# EAGLE design motherboardv2 (EAGLE 5.11)
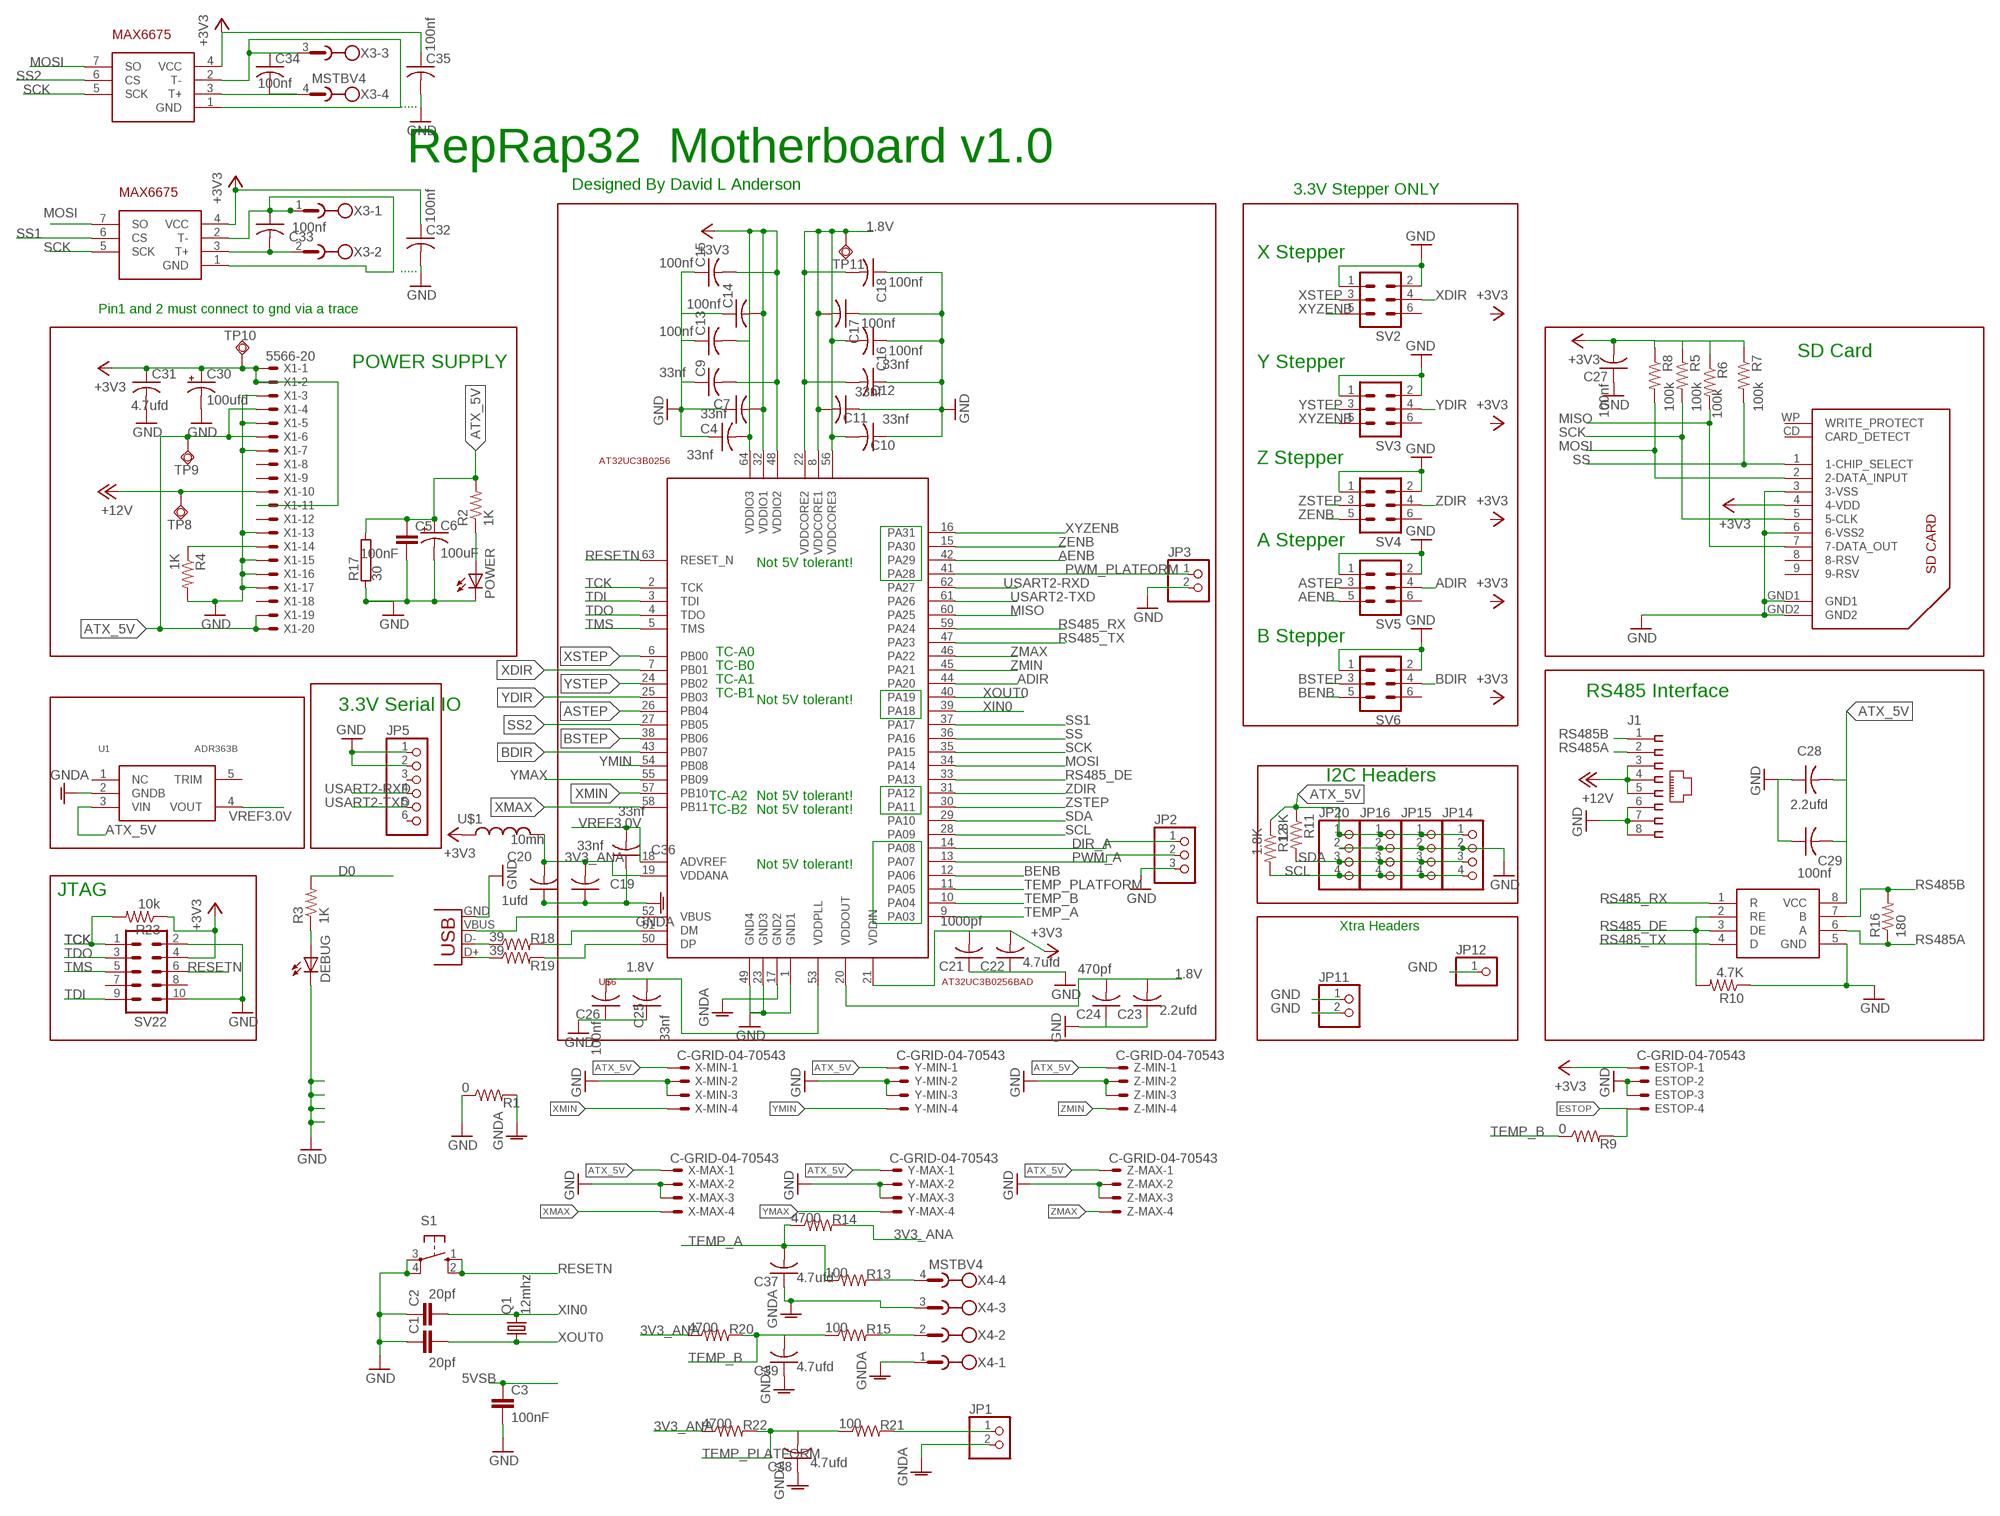
[diagram p0: schematic, sheet 1]

## Parts
C1  20pf  C-EUC1206  [C1206]
C2  20pf  C-EUC1206  [C1206]
C3  100nF  C-EUC1206  [C1206]
C4  33nf  C-USC0603K  [C0603K]
C5  100nF  C-EUC1206  [C1206]
C6  100uF  CPOL-USE5-6  [E5-6]
C7  33nf  C-USC0603K  [C0603K]
C9  33nf  C-USC0603K  [C0603K]
C10  33nf  C-USC0603K  [C0603K]
C11  33nf  C-USC0603K  [C0603K]
C12  33nf  C-USC0603K  [C0603K]
C13  100nf  C-USC0603K  [C0603K]
C14  100nf  C-USC0603K  [C0603K]
C15  100nf  C-USC0603K  [C0603K]
C16  100nf  C-USC0603K  [C0603K]
C17  100nf  C-USC0603K  [C0603K]
C18  100nf  C-USC0603K  [C0603K]
C19  33nf  C-USC0603K  [C0603K]
C20  1ufd  C-USC0603K  [C0603K]
C21  1000pf  C-USC0603K  [C0603K]
C22  4.7ufd  C-USC0603K  [C0603K]
C23  2.2ufd  C-USC0603K  [C0603K]
C24  470pf  C-USC0603K  [C0603K]
C25  33nf  C-USC0603K  [C0603K]
C26  100nf  C-USC0603K  [C0603K]
C27  100nf  C-USC0603K  [C0603K]
C28  2.2ufd  C-USC0603K  [C0603K]
C29  100nf  C-USC0603K  [C0603K]
C30  100ufd  CPOL-USE5-6  [E5-6]
C31  4.7ufd  C-USC0603K  [C0603K]
C32  100nf  C-USC0603K  [C0603K]
C33  100nf  C-USC0603K  [C0603K]
C34  100nf  C-USC0603K  [C0603K]
C35  100nf  C-USC0603K  [C0603K]
C36  33nf  C-USC0603K  [C0603K]
C37  4.7ufd  C-USC0603K  [C0603K]
C38  4.7ufd  C-USC0603K  [C0603K]
C39  4.7ufd  C-USC0603K  [C0603K]
DEBUG  LEDCHIPLED_1206  [CHIPLED_1206]
ESTOP  C-GRID-04-70543  [70543-04]
IC1  SN75176ASOIC  [SO08]
J1  555164-1  [555164-1]
JP1  PINHD-1X2  [1X02]
JP2  PINHD-1X3  [1X03]
JP3  PINHD-1X2  [1X02]
JP5  PINHD-1X6  [1X06]
JP11  PINHD-1X2  [1X02]
JP12  PINHD-1X1  [1X01]
JP14  PINHD-1X4  [1X04]
JP15  PINHD-1X4  [1X04]
JP16  PINHD-1X4  [1X04]
JP20  PINHD-1X4  [1X04]
POWER  LEDCHIPLED_1206  [CHIPLED_1206]
Q1  12mhz  CRYSTAL5X3  [CRYSTAL-SMD-5X3]
R1  0  R-US_R0603  [R0603]
R2  1K  R-US_R0603  [R0603]
R3  1K  R-US_R0603  [R0603]
R4  1K  R-US_R1206  [R1206]
R5  100k  R-US_R0603  [R0603]
R6  100k  R-US_R0603  [R0603]
R7  100k  R-US_R0603  [R0603]
R8  100k  R-US_R0603  [R0603]
R9  0  R-US_R0603  [R0603]
R10  4.7K  R-US_R0603  [R0603]
R11  1.8K  R-US_R0603  [R0603]
R12  1.8K  R-US_R0603  [R0603]
R13  100  R-US_R0603  [R0603]
R14  4700  R-US_R0603  [R0603]
R15  100  R-US_R0603  [R0603]
R16  180  R-US_R0603  [R0603]
R17  30  RKH206-8  [KH206-8]
R18  39  R-US_R0603  [R0603]
R19  39  R-US_R0603  [R0603]
R20  4700  R-US_R0603  [R0603]
R21  100  R-US_R0603  [R0603]
R22  4700  R-US_R0603  [R0603]
R23  10k  R-US_R0603  [R0603]
S1  10-XX  [B3F-10XX]
SV2  ML6  [ML6]
SV3  ML6  [ML6]
SV4  ML6  [ML6]
SV5  ML6  [ML6]
SV6  ML6  [ML6]
SV22  ML10  [ML10]
TP8  TPSQTP09R  [TP09R]
TP9  TPSQTP09R  [TP09R]
TP10  TPSQTP09R  [TP09R]
TP11  TPSQTP09R  [TP09R]
U1  ADR363B  [SOT23-5]
U$1  10mh  INDUCTOR1210  [1210]
U$2  MAX6675  [SO08]
U$6  AT32UC3B0256BAD  [TQFP64]
U$7  MAX6675  [SO08]
U$8  SDCARD  [3M-SDCARD]
X1  5566-20  [5566-20]
X2  USBSMD  [USB-MINIB]
X3  MSTBV4  [MSTBV4]
X4  MSTBV4  [MSTBV4]
X-MAX  C-GRID-04-70543  [70543-04]
X-MIN  C-GRID-04-70543  [70543-04]
Y-MAX  C-GRID-04-70543  [70543-04]
Y-MIN  C-GRID-04-70543  [70543-04]
Z-MAX  C-GRID-04-70543  [70543-04]
Z-MIN  C-GRID-04-70543  [70543-04]

## Nets
1.8V: C10.2 C11.2 C12.2 C16.2 C17.2 C18.2 C23.2 C24.2 C25.2 C26.2 TP11.TP U$6.8(VDDCORE1) U$6.20(VDDOUT) U$6.22(VDDCORE2) U$6.53(VDDPLL) U$6.56(VDDCORE3)
3V3_ANA: C19.2 C20.2 R14.2 R20.1 R22.1 U$1.2 U$6.19(VDDANA)
5VSB: C3.1
+3V3: C4.2 C7.2 C9.2 C13.2 C14.2 C15.2 C21.2 C22.2 C27.2 C30.+ C31.1 C32.1 C35.1 ESTOP.1 R5.1 R6.1 R7.1 R8.1 R23.1 SV22.4 TP10.TP U$1.1 U$2.4(VCC) U$6.21(VDDIN) U$6.32(VDDIO1) U$6.48(VDDIO2) U$6.64(VDDIO3) U$7.4(VCC) U$8.4(4-VDD) X1.1 X1.2 X1.11
+12V: J1.3 J1.4 J1.5 TP8.TP X1.10
ADIR: SV5.4 U$6.44(PA20)
AENB: SV5.5 U$6.42(PA29)
ASTEP: SV5.3 U$6.26(PB04)
ATX_5V [usbvcc]: C5.1 C6.+ C28.2 C29.2 IC1.8(VCC) JP14.1 JP15.1 JP16.1 JP20.1 R2.2 R11.1 R12.1 R17.2 TP9.TP U1.3(VIN) X1.4 X1.6 X1.19 X1.20 X-MAX.1 X-MIN.1 Y-MAX.1 Y-MIN.1 Z-MAX.1 Z-MIN.1
BDIR: SV6.4 U$6.43(PB07)
BENB: SV6.5 U$6.12(PA06)
BSTEP: SV6.3 U$6.38(PB06)
D0: R3.2
DIR_A: JP2.1 U$6.14(PA08)
ESTOP: ESTOP.4 R9.2
GND [power]: C1.1 C2.1 C3.2 C4.1 C5.2 C6.- C7.1 C9.1 C10.1 C11.1 C12.1 C13.1 C14.1 C15.1 C16.1 C17.1 C18.1 C21.1 C22.1 C23.1 C24.1 C25.1 C26.1 C27.1 C28.1 C29.1 C30.- C31.2 C32.2 C35.2 DEBUG.C ESTOP.2 ESTOP.3 IC1.5(GND) J1.6 J1.7 J1.8 JP2.3 JP3.2 JP5.1 JP5.2 JP11.1 JP11.2 JP12.1 JP14.2 JP15.2 JP16.2 JP20.2 POWER.C R1.1 R4.2 R10.1 R17.1 S1.3(P) S1.4(P1) SV2.1 SV2.2 SV3.1 SV3.2 SV4.1 SV4.2 SV5.1 SV5.2 SV6.1 SV6.2 SV22.2 SV22.10 U$6.1(GND1) U$6.23(GND3) U$6.49(GND4) U$8.3(3-VSS) U$8.6(6-VSS2) U$8.GND1 U$8.GND2 X1.3 X1.5 X1.7 X1.13 X1.15 X1.16 X1.17 X2.GND X-MAX.2 X-MAX.3 X-MIN.2 X-MIN.3 Y-MAX.2 Y-MAX.3 Y-MIN.2 Y-MIN.3 Z-MAX.2 Z-MAX.3 Z-MIN.2 Z-MIN.3
GNDA: C19.1 C20.1 C36.1 C37.1 C38.1 C39.1 JP1.2 R1.2 U1.2(GNDB) U$6.17(GND2) X4.1 X4.3
MISO: R6.2 U$6.60(PA25) U$8.7(7-DATA_OUT)
MOSI: R8.2 U$2.7(SO) U$6.34(PA14) U$7.7(SO) U$8.2(2-DATA_INPUT)
N$3: R18.2 U$6.51(DM)
N$4: POWER.A R2.1
N$5: R4.1 X1.14
N$6: R19.2 U$6.50(DP)
N$7: DEBUG.A R3.1
N$9: R18.1 X2.D-
N$10: R19.1 X2.D+
N$11: U$6.52(VBUS) X2.VBUS
N$12: JP1.1 R21.2
N$13: C33.1 U$7.1(GND) U$7.2(T-) X3.1
N$15: C33.2 U$7.3(T+) X3.2
N$16: C34.2 U$2.3(T+) X3.4
N$18: C34.1 U$2.1(GND) U$2.2(T-) X3.3
N$19: R13.2 X4.4
N$22: R15.2 X4.2
PWM_A: JP2.2 U$6.13(PA07)
PWM_PLATFORM: JP3.1 U$6.41(PA28)
RESETN: S1.1(S) S1.2(S1) SV22.6 U$6.63(RESET_N)
RS485_DE: IC1.2(RE) IC1.3(DE) R10.2 U$6.33(PA13)
RS485_RX: IC1.1(R) U$6.59(PA24)
RS485_TX: IC1.4(D) U$6.47(PA23)
RS485A: IC1.6(A) J1.2 R16.1
RS485B: IC1.7(B) J1.1 R16.2
SCK: R5.2 U$2.5(SCK) U$6.35(PA15) U$7.5(SCK) U$8.5(5-CLK)
SCL: JP14.4 JP15.4 JP16.4 JP20.4 R12.2 U$6.28(PA09)
SDA: JP14.3 JP15.3 JP16.3 JP20.3 R11.2 U$6.29(PA10)
SS: R7.2 U$6.36(PA16) U$8.1(1-CHIP_SELECT)
SS1: U$6.37(PA17) U$7.6(CS)
SS2: U$2.6(CS) U$6.27(PB05)
TCK: R23.2 SV22.1 U$6.2(TCK)
TDI: SV22.9 U$6.3(TDI)
TDO: SV22.3 U$6.4(TDO)
TEMP_A: C37.2 R13.1 R14.1 U$6.9(PA03)
TEMP_B: C39.2 R9.1 R15.1 R20.2 U$6.10(PA04)
TEMP_PLATFORM: C38.2 R21.1 R22.2 U$6.11(PA05)
TMS: SV22.5 U$6.5(TMS)
USART2-RXD: JP5.4 U$6.62(PA27)
USART2-TXD: JP5.5 U$6.61(PA26)
VREF3.0V: C36.2 U1.4(VOUT) U$6.18(ADVREF)
XDIR: SV2.4 U$6.7(PB01)
XIN0: C2.2 Q1.3 U$6.39(PA18)
XMAX: U$6.58(PB11) X-MAX.4
XMIN: U$6.57(PB10) X-MIN.4
XOUT0: C1.2 Q1.1 U$6.40(PA19)
XSTEP: SV2.3 U$6.6(PB00)
XYZENB: SV2.5 SV3.5 U$6.16(PA31)
YDIR: SV3.4 U$6.25(PB03)
YMAX: U$6.55(PB09) Y-MAX.4
YMIN: U$6.54(PB08) Y-MIN.4
YSTEP: SV3.3 U$6.24(PB02)
ZDIR: SV4.4 U$6.31(PA12)
ZENB: SV4.5 U$6.15(PA30)
ZMAX: U$6.46(PA22) Z-MAX.4
ZMIN: U$6.45(PA21) Z-MIN.4
ZSTEP: SV4.3 U$6.30(PA11)
Unconnected: JP5.3 JP5.6 SV2.6 SV3.6 SV4.6 SV5.6 SV6.6 SV22.7 SV22.8 U1.1(NC) U1.5(TRIM) U$8.8(8-RSV) U$8.9(9-RSV) U$8.CD(CARD_DETECT) U$8.WP(WRITE_PROTECT) X1.8 X1.9 X1.12 X1.18

## Notes on the sheet
- .....
- RepRap32  Motherboard v1.0
- Designed By David L Anderson
- 3.3V Stepper ONLY
- X Stepper
- .....
- Pin1 and 2 must connect to gnd via a trace
- SD Card
- POWER SUPPLY | Y Stepper
- Z Stepper
- A Stepper
- Not 5V tolerant!
- B Stepper
- TC-A0
- TC-B0
- TC-A1
- TC-B1 | RS485 Interface
- Not 5V tolerant!
- 3.3V Serial IO
- I2C Headers
- TC-A2 | Not 5V tolerant!
- TC-B2 | Not 5V tolerant!
- Not 5V tolerant!
- JTAG
- Xtra Headers

## Library data of the parts
C1-C3 C5 = rcl:C-EU: CAPACITOR, European symbol
C4 C7 C9-C29 C31-C39 = rcl:C-US: CAPACITOR, American symbol
C6 C30 = rcl:CPOL-US: POLARIZED CAPACITOR, American symbol
DEBUG POWER = led:LED: LED OSRAM: - CHIPLED LG R971, LG N971, LY N971, LG Q971, LY Q971, LO R971, LY R971 LH N974, LH R974 LS Q976, LO Q976, LY Q976 LO Q996 - Hyper CHIPLED LW Q18S LB Q993, LB Q99A, LB R99A - SideLED LS A670, LO A670, LY A670, LG A670, LP A670 LB A673, LV A673, LT A673, LW A673 LH A674 LY A675 LS A676, LA A676, LO A676, LY A676, LW A676 LS A679, LY A679, LG A679 - Hyper Micro SIDELED® LS Y876, LA Y876, LO Y876, LY Y876 LT Y87S - SmartLED LW L88C, LW L88S LB L89C, LB L89S, LG L890 LS L89K, LO L89K, LY L89K LS L896, LA L896, LO L896, LY L896 - TOPLED LS T670, LO T670, LY T670, LG T670, LP T670 LSG T670, LSP T670, LSY T670, LOP T670, LYG T670 LG T671, LOG T671, LSG T671 LB T673, LV T673, LT T673, LW T673 LH T674 LS T676, LA T676, LO T676, LY T676, LB T676, LH T676, LSB T676, LW T676 LB T67C, LV T67C, LT T67C, LS T67K, LO T67K, LY T67K, LW E67C LS E67B, LA E67B, LO E67B, LY E67B, LB E67C, LV E67C, LT E67C LW T67C LS T679, LY T679, LG T679 LS T770, LO T770, LY T770, LG T770, LP T770 LB T773, LV T773, LT T773, LW T773 LH T774 LS E675, LA E675, LY E675, LS T675 LS T776, LA T776, LO T776, LY T776, LB T776 LHGB T686 LT T68C, LB T68C - Hyper Mini TOPLED® LB M676 - Mini TOPLED Santana® LG M470 LS M47K, LO M47K, LY M47K Source: http://www.osram.convergy.de - LUMILED® LXK2-PW12-R00, LXK2-PW12-S00, LXK2-PW14-U00, LXK2-PW14-V00 LXK2-PM12-R00, LXK2-PM12-S00, LXK2-PM14-U00 LXK2-PE12-Q00, LXK2-PE12-R00, LXK2-PE12-S00, LXK2-PE14-T00, LXK2-PE14-U00 LXK2-PB12-K00, LXK2-PB12-L00, LXK2-PB12-M00, LXK2-PB14-N00, LXK2-PB14-P00, LXK2-PB14-Q00 LXK2-PR12-L00, LXK2-PR12-M00, LXK2-PR14-Q00, LXK2-PR14-R00 LXK2-PD12-Q00, LXK2-PD12-R00, LXK2-PD12-S00 LXK2-PH12-R00, LXK2-PH12-S00 LXK2-PL12-P00, LXK2-PL12-Q00, LXK2-PL12-R00 Source: www.luxeon.com
ESTOP X-MAX X-MIN Y-MAX Y-MIN Z-MAX Z-MIN = con-molex:C-GRID-04: CONNECTOR wire to board 2.54 mm (0.100") pitch header
IC1 = reprap:SN75176A
J1 = con-amp:555164-1: AMP connector
JP1 JP3 JP11 = pinhead:PINHD-1X2: PIN HEADER
JP2 = pinhead:PINHD-1X3: PIN HEADER
JP5 = pinhead:PINHD-1X6: PIN HEADER
JP12 = pinhead:PINHD-1X1: PIN HEADER
JP14-JP16 JP20 = pinhead:PINHD-1X4: PIN HEADER
Q1 = SparkFun_4_13_2010:CRYSTAL: Crystals Various standard crystals. Proven footprints. Spark Fun Electronics SKU : COM-00534
R1-R16 R18-R23 = rcl:R-US_: RESISTOR, American symbol
R17 = resistor-power:R: Power Resitor
S1 = switch-omron:10-XX: OMRON SWITCH
SV2-SV6 = con-ml:ML6: HARTING
SV22 = con-harting-ml:ML10: HARTING
TP8-TP11 = testpad:TPSQ: Test pad
U1 = dave2010:ADR363B: ADR363 3.0V Reference
U$1 = SparkFun_4_13_2010:INDUCTOR: Inductors Basic Inductor/Choke - 0603 and 1206. Footprints are not proven and vary greatly between part numbers.
U$2 U$7 = reprap:MAX6675: Thermocouple amplifier and A to D converter
U$6 = dave2010:AT32UC3B0256
U$8 = reprap:SDCARD
X1 = con-molex:5566-20: Mini FIT connector 20 pol ATX PC-Motherboard Power connector Source: http://www.molex.com
X2 = SparkFun_4_13_2010:USB: USB Connectors USB-B-PTH is fully proven SKU : PRT-00139 USB-miniB is fully proven SKU : PRT-00587 USB-A-PCB is untested. USB-A-H is throughly reviewed, but untested. Spark Fun Electronics SKU : PRT-00437 USB-B-SMT is throughly reviewed, but untested. Needs silkscreen touching up. USB-A-S has not been used/tested USB-MB-H has not been used/tested
X3 X4 = con-phoenix-508:MSTBV4: PHOENIX

## Net classes
0 default: width 0.203 mm, clearance 0.152 mm
1 power: width 0.61 mm, clearance 0.152 mm
2 gnd: width 0.305 mm, drill 0.584 mm, clearance 0.152 mm
3 usbvcc: width 0.406 mm, drill 0.584 mm, clearance 0.152 mm

## Board
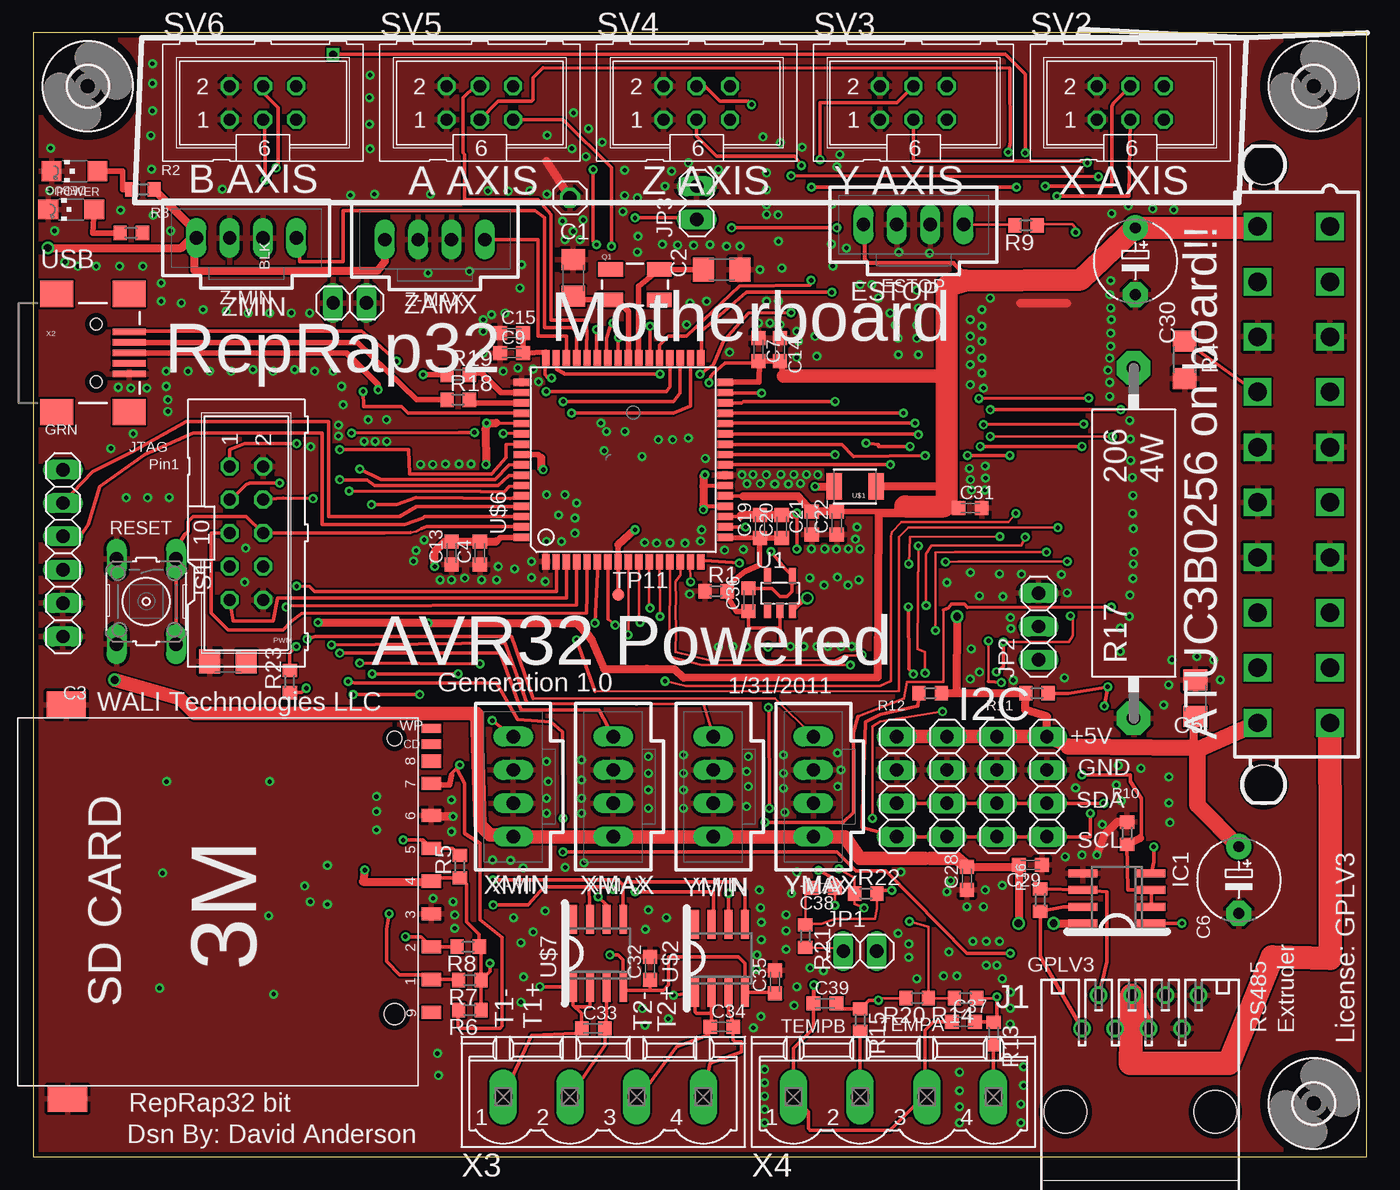
[diagram p1: board, top side]
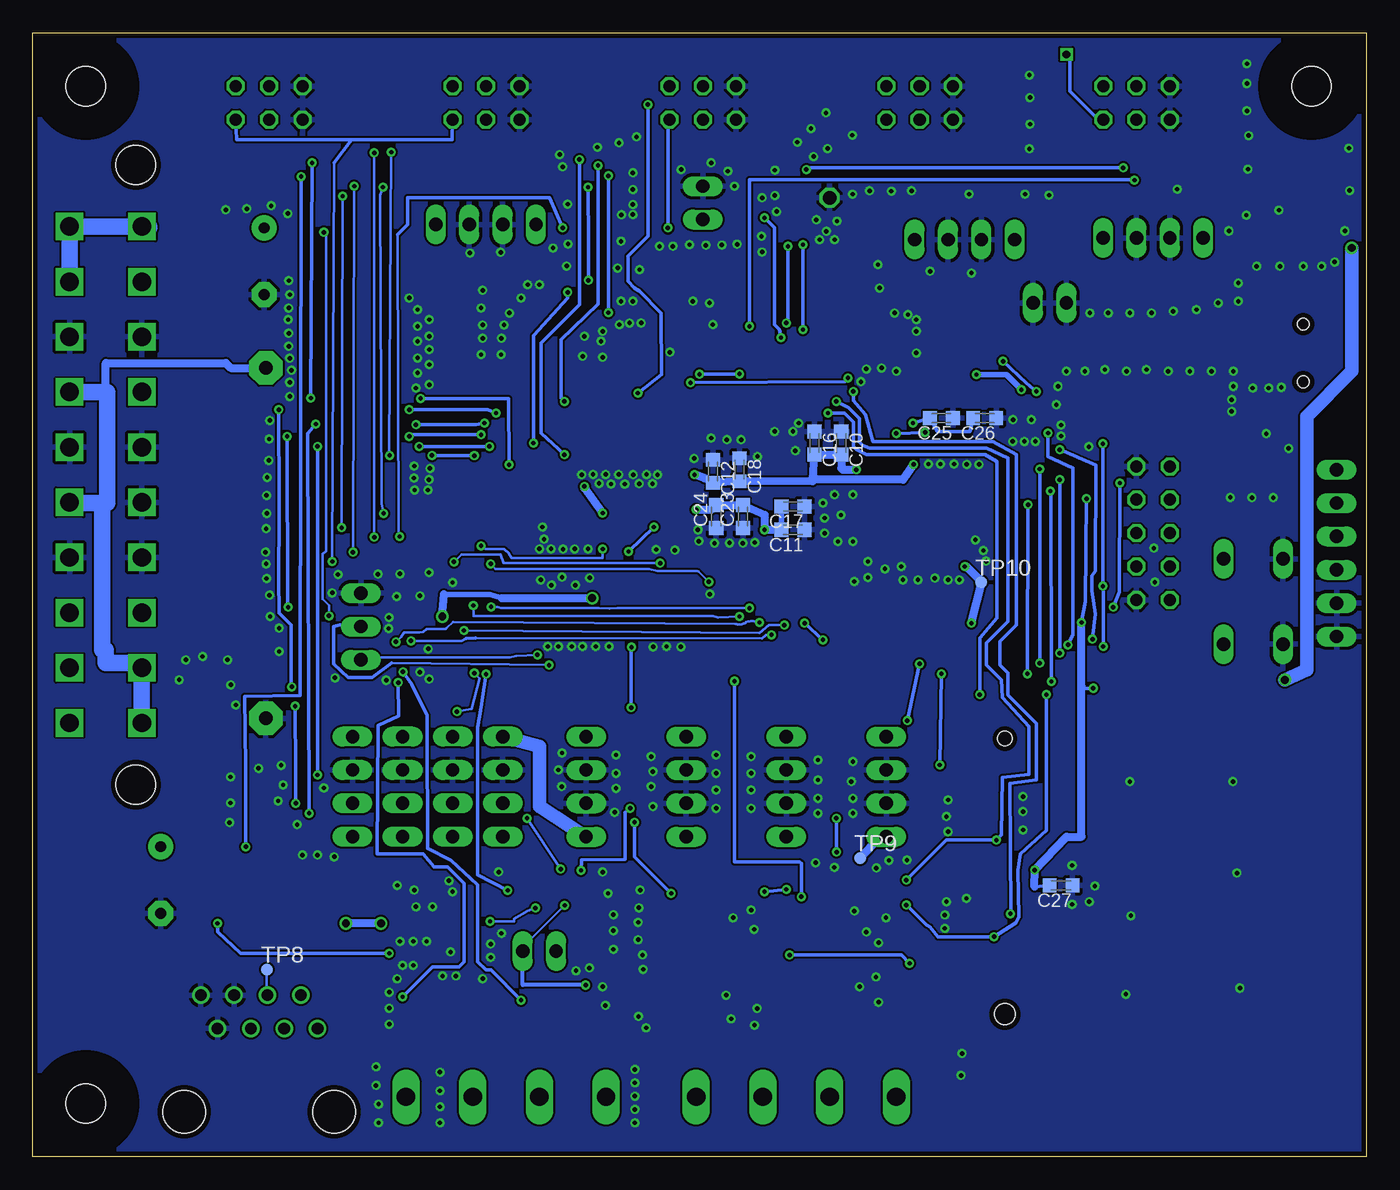
[diagram p2: board, bottom side, seen from below]

Size 101.52 x 85.59 mm. Coordinates in mm from the lower left corner, seen from the top.
Outline: 0,0 101.52,0 101.52,85.59 0,85.59 0,0
Copper layers (1*16): Top 0.0356mm / dielectric 1.5011mm / Bottom 0.0356mm
Design rules "LaenPCBOrder": minimum track width 6mil, minimum drill 13mil, track to track 6mil, track to pad 6mil, pad to pad 6mil, via to via 6mil, smd to smd 6mil, copper to edge 15mil, drill to drill 6mil, minimum pad ring 7mil, minimum via ring 7mil, stop-mask expansion 4mil, vias tented up to drill 0mil, thermal gap 10mil

### Footprints (pad centres in the part's own frame; a part is rotated, then mirrored left to right if it is on the bottom)
C1206 = smd 1.6 x 1.8: 1 -1.4,0; 2 1.4,0
C0603K = smd 1.05 x 1.08: 1 -0.875,0; 2 0.875,0
E5-6 = drill 0.813 pad 1.905 round: + -2.54,0 | drill 0.813 pad 1.905 octagon: - 2.54,0
CHIPLED_1206 = smd 1.5 x 1.5: A 0,-1.75; C 0,1.75
70543-04 = drill 1.016 long: 1 -3.81,0; 2 -1.27,0; 3 1.27,0; 4 3.81,0
SO08 = smd 0.6 x 2.2: 1 -1.905,-2.6; 2 -0.635,-2.6; 3 0.635,-2.6; 4 1.905,-2.6; 5 1.905,2.6; 6 0.635,2.6; 7 -0.635,2.6; 8 -1.905,2.6
555164-1 = drill 0.889 round: 1 -4.445,5.207; 2 -3.175,7.747; 3 -1.905,5.207; 4 -0.635,7.747; 5 0.635,5.207; 6 1.905,7.747; 7 3.175,5.207; 8 4.445,7.747 | hole 3.251: -5.715,-1.143; 5.715,-1.143
1X02 = drill 1.016 long: 1 -1.27,0; 2 1.27,0
1X03 = drill 1.016 long: 1 -2.54,0; 2 0,0; 3 2.54,0
1X06 = drill 1.016 long: 1 -6.35,0; 2 -3.81,0; 3 -1.27,0; 4 1.27,0; 5 3.81,0; 6 6.35,0
1X01 = drill 1.016 octagon: 1 0,0
1X04 = drill 1.016 long: 1 -3.81,0; 2 -1.27,0; 3 1.27,0; 4 3.81,0
CRYSTAL-SMD-5X3 = smd 1.9 x 1.1: 1 -1.85,-1.15; 2 1.85,-1.15; 3 1.85,1.15; 4 -1.85,1.15
R0603 = smd 1 x 1.1: 1 -0.85,0; 2 0.85,0
R1206 = smd 1.6 x 1.803: 1 -1.422,0; 2 1.422,0
KH206-8 = drill 1.016 pad 2.54 octagon: 1 -13.335,0; 2 13.335,0
B3F-10XX = drill 1.016 long: 1 -3.251,2.261; 2 3.251,2.261; 3 -3.251,-2.261; 4 3.251,-2.261
ML6 = drill 0.914 octagon: 1 -2.54,-1.27; 2 -2.54,1.27; 3 0,-1.27; 4 0,1.27; 5 2.54,-1.27; 6 2.54,1.27
ML10 = drill 0.914 octagon: 1 -5.08,-1.27; 2 -5.08,1.27; 3 -2.54,-1.27; 4 -2.54,1.27; 5 0,-1.27; 6 0,1.27; 7 2.54,-1.27; 8 2.54,1.27; 9 5.08,-1.27; 10 5.08,1.27
TP09R = smd 0.9 x 0.9: TP 0,0
SOT23-5 = smd 0.55 x 1.2: 1 -0.95,-1.3; 2 0,-1.3; 3 0.95,-1.3; 4 0.95,1.3; 5 -0.95,1.3
1210 = smd 1.2 x 2: 1 -1.6,0; 2 1.6,0
3,0 = hole 3: 0,0
TQFP64 = smd 1.194 x 0.559: 1 -7.76,5.905; 2 -7.76,5.118; 3 -7.76,4.331; 4 -7.76,3.543; 5 -7.76,2.756; 6 -7.76,1.968; 7 -7.76,1.181; 8 -7.76,0.394; 9 -7.76,-0.394; 10 -7.76,-1.181; 11 -7.76,-1.968; 12 -7.76,-2.756; 13 -7.76,-3.543; 14 -7.76,-4.331; 15 -7.76,-5.118; 16 -7.76,-5.905; 33 7.76,-5.905; 34 7.76,-5.118; 35 7.76,-4.331; 36 7.76,-3.543; 37 7.76,-2.756; 38 7.76,-1.968; 39 7.76,-1.181; 40 7.76,-0.394; 41 7.76,0.394; 42 7.76,1.181; 43 7.76,1.968; 44 7.76,2.756; 45 7.76,3.543; 46 7.76,4.331; 47 7.76,5.118; 48 7.76,5.905 | smd 0.559 x 1.194: 17 -5.905,-7.76; 18 -5.118,-7.76; 19 -4.331,-7.76; 20 -3.543,-7.76; 21 -2.756,-7.76; 22 -1.968,-7.76; 23 -1.181,-7.76; 24 -0.394,-7.76; 25 0.394,-7.76; 26 1.181,-7.76; 27 1.968,-7.76; 28 2.756,-7.76; 29 3.543,-7.76; 30 4.331,-7.76; 31 5.118,-7.76; 32 5.905,-7.76; 49 5.905,7.76; 50 5.118,7.76; 51 4.331,7.76; 52 3.543,7.76; 53 2.756,7.76; 54 1.968,7.76; 55 1.181,7.76; 56 0.394,7.76; 57 -0.394,7.76; 58 -1.181,7.76; 59 -1.968,7.76; 60 -2.756,7.76; 61 -3.543,7.76; 62 -4.331,7.76; 63 -5.118,7.76; 64 -5.905,7.76
3M-SDCARD = smd 1 x 1.5: 1 5.93,16.5; 2 3.43,16.5; 3 0.93,16.5; 4 -1.57,16.5; 5 -4.07,16.5; 6 -6.57,16.5; 7 -9,16.5; 8 -10.7,16.5; 9 8.43,16.5 | smd 0.7 x 1.5: CD -12,16.5; WP -13.2,16.5 | smd 2 x 3: GND1 -15,-11.3; GND2 15,-11.2 | hole 1.1: -12.427,13.705 | hole 1.6: 8.567,13.708
5566-20 = drill 1.4 square: 1 18.9,-2.75; 2 14.7,-2.75; 3 10.5,-2.75; 4 6.3,-2.75; 5 2.1,-2.75; 6 -2.1,-2.75; 7 -6.3,-2.75; 8 -10.5,-2.75; 9 -14.7,-2.75; 10 -18.9,-2.75; 11 18.9,2.75; 12 14.7,2.75; 13 10.5,2.75; 14 6.3,2.75; 15 2.1,2.75; 16 -2.1,2.75; 17 -6.3,2.75; 18 -10.5,2.75; 19 -14.7,2.75; 20 -18.9,2.75 | hole 3: 23.6,2.29; -23.6,2.29
USB-MINIB = smd 2.5 x 0.5: D+ 2.5,0; D- 2.5,0.8; GND 2.5,-1.6; ID 2.5,-0.8; VBUS 2.5,1.6 | smd 2.5 x 2: GND@1 -3,-4.5; GND@2 -3,4.5; GND@3 2.5,4.5; GND@4 2.5,-4.5 | hole 0.9: 0,2.2; 0,-2.2
MSTBV4 = drill 1.397 long: 1 -7.62,0; 2 -2.54,0; 3 2.54,0; 4 7.62,0

### Placement (x,y rotation side)
C1  41.11,66.92 270 top
C2  52.41,67.56 180 top
C3  14.82,37.71 180 top
C4  34,45.97 90 top
C5  88.48,34.92 90 top
C6  91.78,21.08 270 top
C7  55.21,61.46 270 top
C9  36.41,61.21 0 top
C10  39.97,54.35 270 bottom
C11  43.65,47.75 180 bottom
C12  49.75,52.19 270 bottom
C13  31.84,45.97 90 top
C14  56.86,61.46 270 top
C15  36.41,62.73 0 top
C16  42,54.35 270 bottom
C17  43.65,49.53 180 bottom
C18  47.71,52.32 270 bottom
C19  55.33,48 90 top
C20  56.98,48 90 top
C21  59.27,48.26 90 top
C22  61.18,48.26 90 top
C23  47.46,48.76 90 bottom
C24  49.49,48.76 90 bottom
C25  32.35,56.26 180 bottom
C26  29.04,56.26 180 bottom
C27  23.23,20.67 180 bottom
C28  71.08,21.2 90 top
C29  75.91,22.22 180 top
C30  83.91,68.19 270 top
C31  71.34,49.4 0 top
C32  46.95,14.35 90 top
C33  42.63,9.77 0 top
C34  52.41,9.9 0 top
C35  56.48,13.33 90 top
C36  54.45,42.41 90 top
C37  70.83,10.28 0 top
C38  60.16,20.47 180 top
C39  60.29,11.68 0 top
DEBUG  2.88,72.13 90 top
ESTOP  67.02,70.99 0 top
IC1  82.51,19.68 90 top
J1  84.29,4.57 0 top
JP1  62.95,15.67 0 top
JP2  76.54,40.38 90 top
JP3  50.51,72.64 90 top
JP5  2.25,45.97 90 top
JP11  24.09,65.02 0 top
JP12  40.86,73.02 0 top
JP14  73.37,28.19 270 top
JP15  65.75,28.19 270 top
JP16  69.56,28.19 270 top
JP20  77.18,28.19 270 top
POWER  3.14,75.05 90 top
Q1  45.81,66.42 0 top
R1  51.98,43.07 0 top
R2  8.34,73.66 0 top
R3  7.45,70.35 0 top
R4  87.67,60.68 270 top
R5  32.47,22.09 90 top
R6  33.24,11.17 180 top
R7  33.24,13.46 180 top
R8  33.11,16 180 top
R9  75.58,70.91 180 top
R10  83.27,24.63 270 top
R11  76.42,35.3 0 top
R12  68.29,35.3 180 top
R13  73.11,9.39 270 top
R14  70.98,12.09 180 top
R15  62.95,10.41 270 top
R16  76.67,19.55 270 top
R17  83.78,46.73 90 top
R18  32.35,57.65 0 top
R19  32.35,59.56 0 top
R20  67.3,12.09 180 top
R21  58.79,16.81 270 top
R22  63.39,20.04 0 top
R23  19.52,36.19 90 top
S1  8.6,42.29 270 top
SV2  83.53,80.26 0 top
SV3  67.02,80.26 0 top
SV4  50.51,80.26 0 top
SV5  34,80.26 0 top
SV6  17.49,80.26 0 top
SV22  16.22,47.49 270 top
TP8  83.71,14.27 0 bottom
TP9  38.54,22.75 0 bottom
TP10  29.32,43.73 0 bottom
TP11  44.54,42.79 0 top
U1  56.86,42.92 0 top
U$1  62.57,51.05 180 top
U$2  52.29,15.11 0 top
U$3  [3,0]  4.15,81.53 0 top
U$4  [3,0]  97.5,81.53 0 top
U$5  [3,0]  97.5,4.06 0 top
U$6  44.92,53.08 90 top
U$7  43.02,15.49 0 top
U$8  13.81,19.43 270 top
X1  95.97,51.94 90 top
X2  4.79,61.21 0 top
X3  43.4,4.57 0 top
X4  65.49,4.57 0 top
X-MAX  44.16,28.19 90 top
X-MIN  36.54,28.19 90 top
Y-MAX  59.4,28.19 90 top
Y-MIN  51.78,28.19 90 top
Z-MAX  30.57,69.84 0 top
Z-MIN  16.22,69.97 0 top

### Tracks (layer width: path | path; a pad name or v marks a point on that pad's centre or on a via)
1.8V  (via drill 0.33)
  Top 0.203: 34.49,55.84 34.49,55.86 v34.51,55.88
  Top 0.254: 35.27,55.88 U$6.53
  Top 0.305: 51.13,49.54 U$6.20 | 51.07,51.12 52.54,51.12 | U$6.8 TP11.TP
  Top 0.406: 51.13,49.54 51.02,49.65 v51.02,49.27 | 51.02,51.05 51.07,51.12 | 52.54,51.12 U$6.22 | v51.14,51.94 51.02,51.81 | U$6.56 38.43,53.48 38.7,53.21 | v38.82,52.32 38.7,52.45 | U$6.8 44.54,46.6
  Top 0.61: 51.02,49.65 51.02,51.05 51.02,51.81 | 38.7,52.45 38.7,53.21 | v45.81,47.75 44.54,46.6 | 34.49,55.84 34.43,55.39 v34.46,52.73 | v34.51,55.88 35.27,55.88
  Bottom 0.254: v34.51,55.88 C25.2 32.65,55.22 30.19,55.24 C26.2
  Bottom 0.406: 49.86,49.27 C24.2 | 39.97,52.45 39.84,52.32 | C11.2 C17.2
  Bottom 0.61: v51.14,51.94 50.39,51.68 C12.2 C18.2 42.13,51.43 42.12,51.59 | v51.02,49.27 49.86,49.27 | C24.2 C23.2 45.81,48.89 v45.81,47.75 C11.2 | 39.84,52.32 v38.82,52.32 | 39.97,52.45 C10.2 C16.2 42.12,51.59 | v34.46,52.73 35.27,51.56 42.12,51.59
3V3_ANA  (via drill 0.33)
  Top 0.203: v69.23,33.9 64.5,33.14 63.89,32.76 v63.89,25.78 | v61.33,21.91 62.54,21.23 R22.1 62.54,19.26 v63.26,18.94 | R14.2 R20.1 68.14,12.1 68.14,17.52 v66.71,17.93 | v67.4,46.53 67.32,38.65 67.91,38.45 v67.91,36.83
  Top 0.254: U$6.19 52.69,48.76 53.81,48.76 | v58.13,46.29 v58.13,49.02
  Top 0.61: 53.81,48.76 53.92,48.88 C19.2 C20.2 57.89,48.89 v58.13,49.02 | v59.53,51.05 U$1.2
  Bottom 0.203: v67.91,36.83 67.53,36.42 68.11,34.11 v69.23,33.9 | v61.33,21.91 v63.89,25.78 | v63.26,18.94 63.87,18.74 64.88,18.13 64.88,17.93 v66.71,17.93 | v58.13,46.29 58.15,45.61 65.06,45.61 65.29,45.97 65.62,46.25 65.65,46.3 67.04,46.3 v67.4,46.53
  Bottom 0.61: v58.13,49.02 59.53,50.92 v59.53,51.05
+3V3  (via drill 0.33)
  Top 0.254: 31.31,46.82 C13.2 | SV22.4 19.01,50.16 v21.3,50.11 | v51.45,58.95 51.61,59.44 51.77,59.65 52.67,60.45 55.18,60.45 55.3,60.56 | v39.46,59.3 39.21,59.3 38.95,59.56 38.95,60.78 U$6.48 | 30.55,21.24 U$8.4 | 30.55,21.24 R5.1 32.98,20.73 32.98,17.9 33.96,16.92 R8.1 34.09,15.87 R7.1 | R7.1 R6.1 | 30.51,20.95 30.55,21.24 | 54.06,50.29 54.03,50.33 U$6.21 | 46.95,12.7 45.11,12.7 U$7.4 44.92,14.98 44.54,15.36 v43.9,15.36 | 46.95,12.7 C32.1 | C35.1 56.42,12.51 U$2.4 54.19,14.73 53.68,15.24 48.35,15.24 48.35,13.08 47.97,12.7 46.95,12.7 | R7.1 34.76,14.13 v34.76,14.73 | R23.1 20.45,35.34 v20.79,35.68
  Top 0.305: ESTOP.1 63.34,70.86 63.34,68.32 63.59,68.07 70.07,68.07 70.96,67.17 70.96,66.74 | 69.56,66.29 69.43,65.53 69.43,59.43
  Top 0.406: U$6.32 55.26,58.99 55.3,60.56 C7.2 C14.2 57.13,59.43 | U$6.48 39.02,61.27 37.43,61.21 C9.2 C15.2 | U$6.64 35.59,47.18 35.27,46.86 | C4.2 34.01,46.86 | 66.38,49.53 66.25,49.02 65.61,49.13 C22.2
  Top 0.61: 34.01,46.86 35.27,46.86 | C13.2 C4.2 | C22.2 C21.2 58.24,50.29 54.06,50.29 | v30.57,44.95 30.57,46.08 31.31,46.82 | v21.68,40.69 30.02,40.69 30.02,40.67 v30.06,40.64 41.36,40.64 42.25,39.75 42.51,39.37 43.47,37.13 46.72,37.16 48.81,37.13 49.52,36.5 64.3,36.52 64.38,49.02 66.25,49.02 | 30.51,20.95 25.11,20.95 v25.23,21.84 | 69.56,51.05 U$1.1 | C31.1 69.9,49.47 69.3,49.53
  Top 1.016: 69.43,59.43 57.13,59.43
  Top 1.676: X1.11 93.12,70.73 C30.+ 79.74,66.8 70.96,66.74 69.56,66.29 69.56,51.05 69.56,49.78 69.3,49.53 66.38,49.53
  Bottom 0.254: v21.68,40.69 21.37,42.29 v21.3,50.11 | v51.45,58.95 39.69,59.03 v39.46,59.3 | C27.2 25.25,20.57 | v34.76,14.73 35.4,15.36 v43.9,15.36 | v20.79,35.68 21.55,35.68 21.68,35.81
  Bottom 0.61: v30.06,40.64 29.25,43.76 | v21.68,40.69 21.68,35.81 21.68,24.38 22.82,24.38 v25.23,21.84 25.25,20.57 | v30.57,44.95 30.44,44.95 29.25,43.76 | 29.25,43.76 29.3,43.76 TP10.TP
  Bottom 1.27: X1.2 X1.1 X1.11 | X1.11 92.67,70.84 92.67,70.73 93.22,70.73 X1.11
+12V
  Top 1.016: J1.3 J1.5 J1.4
  Top 1.778: X1.10 98.77,23.62 98.77,15.11 94.32,15.24 91.02,7.11 83.53,7.11 J1.4
  Bottom 0.203: TP8.TP 83.71,12.37 J1.4
ADIR
  Top 0.254: U$6.44 arc-90 42.13,60.88 42.13,62.23 42.15,62.23 42.13,63.7 39.43,63.72 39.41,71.72 38.44,72.89 32.86,72.89 32.86,76.32 32.73,76.45 32.73,80.64 33.62,81.53 SV5.4
AENB  (via drill 0.33)
  Top 0.254: U$6.42 arc-90 43.65,60.93 43.65,62.35 43.93,63.16 v44.16,63.5 | SV5.5 40.35,78.99 44.03,75.31 v44.03,69.34
  Bottom 0.254: v44.03,69.34 44.03,63.62 v44.16,63.5
ASTEP  (via drill 0.33)
  Top 0.254: U$6.26 52.77,54.35 52.79,54.35 52.92,54.22 61.56,54.22 62.45,53.34 v67.91,53.39 | SV5.3 35.4,80.39 37.94,80.39 38.06,80.51 38.06,82.16 38.82,82.93 74.36,82.9 74.38,77.26 v74.23,76.5 | v71.13,53.41 v74.36,53.41
  Bottom 0.203: 74.38,53.72 v74.23,76.5
  Bottom 0.254: v74.36,53.41 74.38,53.72 | v67.91,53.39 v71.13,53.41
ATX_5V  (via drill 0.6)
  Top 0.406: 12.03,69.97 Z-MIN.1 | 58.84,42.64 U1.3
  Top 0.61: JP20.1 77.18,33.52 75.53,34.03 R11.1 70.45,35.3 | 70.45,35.3 R12.1 | 88.62,31.11 88.86,31.11 | Z-MAX.1 26.78,68.19 26.23,67.48 12.26,67.48 12.28,69.84 Z-MIN.1 12.41,70.44 R2.2 | R17.2 83.88,60.02 | C5.1 88.35,33.39 88.35,31.12 | v1.1,69.21 11.27,69.21 12.03,69.97 | C28.2 74.89,22.08 C29.2 75.03,17.79 v75.02,17.77 | v77.69,17.77 IC1.8 | 67.91,22.73 68.29,22.73 | v58.94,42.54 58.84,42.64 | v70.34,41.14 70.32,35.43 70.45,35.3
  Top 1.016: JP15.1 JP16.1 JP14.1 JP20.1 78.83,31.24 | v6.18,36.32 11.14,34.92 12.28,33.78 33.74,33.78 34,25.27 34.76,24.51 36.41,24.51 X-MIN.1 X-MAX.1 Y-MIN.1 Y-MAX.1 61.81,24.38 62.95,22.73 67.91,22.73 | C28.2 70.31,22.73 68.29,22.73
  Top 1.27: 88.86,31.11 X1.20 | 78.83,31.24 88.35,31.12 88.62,31.11 88.62,26.79 C6.+
  Bottom 0.406: 65.8,42.54 66.76,42.82 70.22,42.82
  Bottom 0.61: 95.85,58.24 95.97,58.37 95.97,60.45 86.83,60.45 86.45,60.07 R17.2 | v75.02,17.77 v77.69,17.77 | 65.8,42.54 v58.94,42.54 | v70.34,41.14 70.22,42.82 | X-MIN.1 37.15,24.2 TP9.TP
  Bottom 1.016: JP15.1 62.95,31.24 62.95,26.66 Y-MAX.1 | v6.18,36.32 4.53,37.08 4.53,56.38 1.1,59.81 v1.1,69.21
  Bottom 1.27: X1.4 95.85,58.24 95.85,49.78 96.23,49.78 | 96.23,49.78 98.72,49.78 X1.6 | X1.20 X1.19 93.18,37.24 93.18,37.59 95.97,37.59 95.97,38.6 96.23,38.6 96.23,49.78
BDIR  (via drill 0.33)
  Top 0.254: U$6.43 arc-90 42.89,60.9 42.89,61.34 | 42.89,61.34 42.89,62.23 | SV6.4 17.49,81.02 18.63,79.88 18.63,75.43 v18.5,75.31 | v42.63,75.18 42.63,69.72 v42.89,69.46 | v42.89,62.99 42.89,61.34
  Bottom 0.254: v18.5,75.31 42.51,75.31 v42.63,75.18 | v42.89,69.46 v42.89,62.99
BENB  (via drill 0.33, 0.6)
  Top 0.203: v75.53,47.19 75.22,46.55 68.39,46.55 67.98,45.92 v67.98,41.98 | v47.71,41.14 U$6.12
  Top 0.254: v22.82,83.94 74,83.94 75.53,82.42 v75.53,76.45
  Bottom 0.203: v75.53,47.19 v75.53,76.45 | v47.71,41.14 49.37,41.07 49.72,41.19 67.98,41.19 v67.98,41.98
  Bottom 0.254: SV6.5 20.41,78.99 22.57,81.15 22.57,83.69 v22.82,83.94
BSTEP  (via drill 0.33)
  Top 0.254: U$6.38 arc90 46.95,60.9 v46.95,63.24 | SV6.3 arc-90 17.61,78.86 v17.64,74.37
  Bottom 0.254: v17.64,74.37 arc90 17.74,74.42 46.95,74.39 v46.95,63.24
DIR_A  (via drill 0.33)
  Top 0.203: U$6.14 49.28,44.3 48.91,43.81 48.93,42.31 48.91,41.73 48.93,40.05 48.91,38.43 51.4,37.82 61.02,37.79 61.81,38.17 63,38.17
  Top 0.254: 63,38.17 v63.11,38.22
  Bottom 0.203: v63.11,38.22 64.73,38.12 65.24,38.02 76.11,38.02
  Bottom 0.254: 76.11,38.02 JP2.1
ESTOP
  Top 0.203: ESTOP.4 74.65,70.99 R9.2
GND  (via drill 0.33)
  Top 0.61: R10.1 83.23,25.52 82.56,25.52 81.55,24.51 v80.99,22.98
  Top 0.635: v31.97,25.9 30.95,25.9 U$8.6 | JP12.1 39.08,75.81 | 75.15,65.02 78.7,65.02
  other vias: 36.64,44.78 31.84,43.94 32.86,44.06 34.12,43.94 35.27,43.94 30.98,43.94 35.4,44.95 61.15,46.27 60.26,46.3 59.25,46.3 62.95,46.3 62.07,46.3 62.6,47.04 62.73,47.95 10.12,59.81 10.12,58.67 10.25,57.65 10.25,56.76 11.77,59.81 34.25,62.86 34.25,63.75 34.89,64.13 35.9,64.26 38.06,59.99 36.89,60.07 34.25,61.21 35.78,59.81 38.47,59.02 49.87,54.73 47.59,54.61 41.36,49.78 41.24,48.64 41.24,47.49 47.46,46.73 49.62,46.73 50.89,47.75 43.65,55.24 45.05,55.24 40.48,50.41 39.08,50.41 56.45,51.23 56.91,51.96 57.49,51.23 37.94,45.33 39.08,46.86 40.22,46.86 38.98,43.81 31.97,19.43 32.09,18.41 32.09,17.39 31.84,27.17 31.84,24.76 30.44,19.68 20.66,20.62 22.39,22.19 21.09,19.43 22.39,19.22 26.12,27.43 26.12,26.28 26.12,24.89 39.08,30.09 39.21,28.57 39.08,27.3 39.08,26.16 46.83,30.47 46.83,29.2 46.83,27.93 46.83,26.54 54.45,30.47 54.32,29.33 54.45,28.19 54.32,26.66 61.23,30.75 61.51,29.46 61.25,28.19 57.9,51.96 2.4,68.14 3.39,67.81 4.79,67.81 6.57,67.81 8.34,67.81 9.74,66.54 9.74,65.15 11.27,65.02 12.92,64.51 14.69,64.38 16.34,64.26 18,64.26 19.65,64.26 21.04,64.26 13.42,59.81 15.08,59.81 16.73,59.94 18.25,59.81 19.9,59.94 21.42,59.81 22.82,59.81 23.46,58.67 23.58,57.27 25.49,56.13 26.89,56.13 79.84,22.98 78.58,22.86 72.48,20.31 72.35,19.04 71.08,19.04 69.56,20.19 88.61,38.09 89.88,37.84 90.39,36.32 86.45,35.94 86.7,37.84 38.57,12.95 48.73,12.31 58.13,62.86 56.86,63.37 56.1,63.5 55.21,63.5 58.13,60.88 53.02,61.26 58.26,62.1 53.81,69.34 55.33,67.56 52.79,69.34 41.11,70.48 40.48,69.84 41.62,69.84 72.5,51.68 71.36,51.56 71.36,44.5 72.35,58.54 72.23,59.69 72.23,60.83 72.23,62.1 72.23,63.24 72.23,64.51 72.86,65.4 71.34,63.75 71.34,62.48 71.34,61.46 71.34,60.32 71.34,58.8 83.48,56.08 83.53,54.66 83.55,53.03 83.68,51.73 83.73,50.36 83.71,48.99 83.76,47.82 83.81,46.05 83.76,45.16 83.73,44.04 83.5,42.77 83.45,41.14 82.77,40.25 82.77,38.48 86.07,34.41 67.4,61.08 67.4,64.64 63.84,66.42 64.35,65.4 59.65,60.96 59.53,62.48 65.88,61.08 65.24,64.26 62.95,66.42 48.6,75.05 49.06,69.44 50,65.02 51.27,65.15 49.75,63.37 37.05,66.16 37.17,67.94 30.06,67.3 48.09,73.91 47.89,69.49 50.28,69.41 51.52,69.46 49.87,75.69 52.16,75.18 55.84,74.92 55.84,73.66 55.84,72.51 55.84,71.75 56.73,69.72 56.71,71.72 56.98,67.69 56.73,65.15 55.84,65.15 49.49,30.6 49.49,29.2 49.49,27.93 49.49,26.54 57.11,30.6 57.11,29.2 57.11,28.06 57.21,26.23 41.75,30.22 41.75,28.7 41.75,27.3 41.75,26.16 29.76,46.98 29.15,46.17 28.94,45.36 50.81,46.88 46.55,46.78 48.48,46.76 59.73,51.94 58.86,51.96 58.41,51.28 55.82,51.94 55.36,51.25 54.8,51.96 54.34,51.25 53.96,51.94 62.85,43.94 62.04,43.53 61.23,44.14 60.21,43.53 52.64,46.2 54.06,46.25 71.54,16.4 72.56,16.4 73.57,16.4 72.56,14.57 73.37,14.57 69.71,15.59 69.3,13.76 70.32,13.76 66.66,16.2 66.66,15.18 67.27,13.56 65.85,17.01 74.38,11.32 74.38,10.1 74.38,12.54 59.14,14.37 60.16,14.17 58.13,12.95 57.92,11.53 57.72,20.06 57.32,18.44 57.32,17.22 57.32,15.79 66.05,21.69 69.84,21.03 73.77,20.67 73.77,13.56 58.13,21.69 75.4,6.85 75.4,5.43 75.2,4.01 75.2,2.59 70.52,6.45 70.52,5.02 70.52,3.81 70.52,2.59 55.69,6.65 55.69,5.63 55.69,4.62 55.69,3.6 55.69,2.59 57.65,38.86 58.66,38.86 59.68,38.86 60.49,38.86 61.51,38.86 62.32,38.86 69.56,43.73 71.29,52.42 72.48,52.6 71.44,50.77 72.45,50.77 65.65,63.34 67.27,63.34 65.85,62.33 67.27,62.33 67.27,65.98 75.25,44.37 78.73,42.95 78.3,44.34 78.52,36.47 74.61,36.29 71.34,36.37 46.83,18.79 41.92,22.4 40.5,22.04 34.96,22.6 36.33,22.58 37.3,21.99 38.98,18.71 36.56,18.21 38.06,17.11 37.12,16.3 48.2,18.21 46.6,17.32 37.33,13.69 37.12,11.78 46.37,11.3 48.35,10.51 46.57,10.03 55.41,10.69 54.83,9.82 55.28,20.31 55.38,18.97 55.44,17.85 55.44,16.53 55.11,15.36 55.05,14.27 16.17,46.35 16.09,43.76 21.12,54.07 7.07,50.19 8.7,50.19 10.35,50.21 10.15,28.57 9.84,21.61 9.61,12.85 18,28.57 17.92,18.36 18.3,12.39 30.77,7.87 30.85,6.19 86.47,28.93 84.34,29.59 82.61,29.81 82.46,28.32 82.84,27.1 81.39,25.29 79.36,28.09 86.47,26.94 86.55,25.45 73.57,44.39 59.12,44.09 37.94,44.11 46.04,70.1 45.99,68.91 45.02,73.2 45.99,73.02 44.89,71.98 39.13,77.8 41.01,76.78 41.14,79.5 42.28,78.3 43.32,77.26 33.21,67.43 25.64,82.37 25.59,80.67 25.59,78.63 25.64,76.75 9.08,83.23 9.08,81.73 9.08,79.65 8.95,77.77 14.39,73.68 24.14,73.22 25.97,73.3 30.24,73.3 34.61,73.55 36.16,73.53 42.08,76.17 37.81,73.55 39.1,73.3 41.87,71.34 40.3,71.24 45.02,75.13 6.46,58.59 7.43,58.54 8.65,58.54 1.31,76.8 1.26,73.58 1.61,70.51 6.64,72.08 9.13,71.7 10.45,70.51 9,75.2 5.91,53.94 7.61,55.06 29.48,52.73 30.42,52.73 31.38,52.75 32.42,52.75 33.34,52.75 25.18,54.48 26.02,54.48 26.91,54.48 23.23,55.72 23.23,54.88 43.22,55.88 46.34,53.34 48.68,54.61 51.17,53.18 43.47,53.77 39.99,48.86 55.56,77.67 56.88,77.21 58.53,76.88 61.4,76.32 61.18,75.38 61.91,69.21 60.8,72.54 60.77,69.51 60.87,67.84 72.05,42.72 73.83,42.67 71.41,38.68 72.05,36.9 74.41,41.07 74.43,40.23 52.18,38.83 53.28,38.86 54.29,38.83 49.97,42.84 65.9,68.88 68.24,68.83 82.11,71.83 85.23,72.18 86.83,72.11 82.03,64.64 82.08,63.75 82.03,62.71 82.03,61.72 81.95,65.65 82.03,66.72 81.95,60.8 81.83,59.89 81.95,58.97 81.95,57.91 83.38,72.41
  pour Top: -1.56,86.61 102.58,86.61 102.58,-1.02 -1.56,-1.02
  pour Bottom: -1.56,86.61 102.58,86.61 102.58,-1.02 -1.56,-1.02
GNDA  (via drill 0.33)
  Top 0.203: v61.02,19.15 61.02,20.46 C38.1 | R1.2 52.83,42.98 53.07,43.02
  Top 0.254: 54.43,41.52 C36.1 54.45,40.25 56.73,40.25 56.86,40.13 | 56.86,40.13 U1.2 | C37.1 68.54,10.28 67.91,9.65 67.91,4.69 X4.3 67.78,4.57 65.24,2.03 59.14,2.03 59.02,2.18 59.02,3.42 X4.1 57.87,8.25 59.41,9.79 C39.1 | 56.86,40.13 56.88,40.13 56.88,38.88 56.66,38.96 v55.94,38.81 | v55.97,34.21 56.02,34.21 v56.05,26.54 | v59.78,21.81 61.04,21.18 C38.1
  Top 0.305: C39.1 59.42,11.68 v59.42,13.08
  Top 0.406: 55.28,47.11 U$6.17 | 55.28,47.11 55.28,45.08 54.19,44.57 53.07,43.71 53.07,43.02 52.82,42.69 53.56,41.52 54.43,41.52 | C20.1 C19.1 55.7,47.11 55.28,47.11
  Bottom 0.203: JP1.2 64.22,15.95 v61.02,19.15
  Bottom 0.254: v55.94,38.81 55.97,38.73 v55.97,34.21 | v56.05,26.54 56.43,26.23 56.43,22.65 59.73,22.63 v59.78,21.81
  Bottom 0.305: v59.42,13.08 64.22,13.08 JP1.2
MISO  (via drill 0.33)
  Top 0.254: U$6.60 36.31,50.14 29.15,50.19 27.65,49.65 v25.74,49.65 | 31.84,29.08 31.84,29.2 32.22,29.59 | 32.22,29.59 v32.47,29.84 | v32.35,36.77 v25.79,36.77 | R6.2 32.35,11.13 32.35,9.9 32.47,9.77 35.52,9.77 35.67,9.98 35.67,16.71 34,18.03 34,23.87 32.86,24.63 32.86,28.44 32.22,29.59
  Top 0.406: 31.84,29.08 31.71,28.32 31.2,28.32 U$8.7
  Bottom 0.254: v32.47,29.84 v32.35,36.77 | v25.79,36.77 v25.74,49.65
MOSI  (via drill 0.33)
  Top 0.254: 50,60.88 U$6.34 50.04,57.18 48.73,56.64 v40.98,56.64 | v24.35,35.2 v29.43,35.2 | v28.33,16.76 29.54,16.76 U$8.2 R8.2 | U$7.7 42.25,18.22 42.38,18.23 42.36,19.17 42.33,20.57 | 42.33,20.57 38.88,20.57 37.68,19.17 v35.01,19.17 | U$2.7 51.78,17.83 51.78,20.19 v45.81,20.19 | v44.16,20.37 43.57,20.57 42.33,20.57
  Bottom 0.254: v40.98,56.64 39.74,56.64 39.05,55.95 39.05,54.1 38.8,53.84 38.06,53.46 29.04,53.46 28.11,52.95 28.11,41.02 29.43,39.49 v29.43,35.2 | v24.35,35.2 24.35,24.84 26.33,23.06 26.53,21.81 26.45,18.28 26.66,17.83 v28.33,16.76 32.6,16.76 33.24,17.52 33.49,17.65 v35.01,19.17 | v44.16,20.37 v45.81,20.19
N$3
  Top 0.406: U$6.51 33.18,57.41 R18.2
N$4
  Top 0.406: POWER.A 6.82,75.05 6.82,73.66 R2.1
N$5
  Top 0.254: X1.14 93.17,58.19 R4.1
N$6
  Top 0.406: U$6.50 35.61,58.2 34.12,59.69 33.32,59.69 R19.2
N$7
  Top 0.406: DEBUG.A 4.53,70.35 R3.1
N$9
  Top 0.406: X2.D- 24.69,62.01 29.17,57.65 R18.1
N$10  (via drill 0.33)
  Top 0.406: v29.68,59.56 R19.1 | v26.25,58.41 26.25,58.8 23.84,61.21 X2.D+
  Bottom 0.406: v29.68,59.56 27.39,59.56 v26.25,58.41
N$11  (via drill 0.33)
  Top 0.254: U$6.52 28.54,56.64 28.03,57.15 25.13,57.15 v25.11,58.29 | X2.VBUS 7.34,62.86 24.98,62.86 26.12,61.97 v27.65,60.57
  Bottom 0.254: v27.65,60.57 25.87,58.92 v25.11,58.29
N$12
  Top 0.203: JP1.1 61.05,15.87 59.6,15.9 R21.2
N$13
  Top 0.254: X3.1 37.94,9.27 41.24,9.39 C33.1 41.73,10.17 41.75,10.41 41.75,10.92 | 41.75,10.92 41.11,11.55 41.11,12.82 40.97,12.96 38.5,12.96 U$7.1 | U$7.2 42.38,11.43 41.5,11.44 41.25,11.44 41.75,10.92
N$15
  Top 0.254: X3.2 43.52,8.5 43.52,9.39 | 43.52,9.39 C33.2 | 43.52,9.39 43.65,10.79 U$7.3
N$16
  Top 0.254: U$2.3 52.92,10.92 53.16,10.68 C34.2 53.29,8.9 53.43,8.76 53.94,8.76 53.94,8 51.52,7.11 X3.4
N$18
  Top 0.254: X3.3 46.06,4.44 48.98,8.38 51.41,9.28 C34.1 51.65,10.4 51.65,10.92 | 48.73,12.31 U$2.1 50.38,11.04 50.51,10.92 51.65,10.92 | 51.65,10.92 U$2.2
N$19
  Top 0.254: X4.4 R13.2
N$22
  Top 0.254: X4.2 R15.2
PWM_A  (via drill 0.33)
  Top 0.203: U$6.13 48.46,42.68 48.45,41.27 48.45,38.09 50.86,37.44 v62.22,37.44
  Bottom 0.203: v62.22,37.44 74.21,37.59
  Bottom 0.254: 74.21,37.59 75.7,36.5 77.53,36.5 78.63,37.54 78.63,40.38 78.17,40.51 76.42,40.51 JP2.2
PWM_PLATFORM  (via drill 0.33)
  Top 0.254: U$6.41 44.53,62.21 v44.56,62.38 | v45.81,71.5 50.38,71.5 JP3.1
  Bottom 0.254: v44.56,62.38 44.67,62.99 45.05,63.37 45.05,70.73 v45.81,71.5
RESETN
  Top 0.203: 28.73,47.54 29.13,47.61 29.58,47.85
  Top 0.254: U$6.63 37.12,48 29.93,48 29.58,47.85 | 28.73,47.54 26.76,47.49 SV22.6 16.22,48.76 12.15,48.76 11.77,48.38 11.77,47.62 11.57,47.42 10.63,45.97 10.86,45.69 S1.2 S1.1 10.63,45.51
RS485_DE  (via drill 0.33)
  Top 0.254: v63.41,54.35 64.35,54.22 64.35,54.1 v66.76,54.1 | v79.84,54.1 v72.1,54.1 | v79.84,29.08 83.53,29.08 83.53,28.57 84.37,27.3 84.37,24.35 arc-90 84.29,24.28 | IC1.2 IC1.3 83.33,20.31 R10.2 | v60.8,65.83 54.32,65.83 50.89,62.86 50.89,60.9 U$6.33
  Top 0.61: R10.2 84.29,24.28
  Bottom 0.254: v66.76,54.1 v72.1,54.1 72.23,54.1 | v79.84,29.08 v79.84,54.1 | v63.41,54.35 63.41,62.53 60.8,65.4 v60.8,65.83 60.77,65.81
RS485_RX  (via drill 0.33)
  Top 0.254: U$6.59 36.97,51.1 36.23,51.05 35.83,50.62 34.05,50.64 v24.04,50.69 | v23.96,36.19 24.45,36.06 35.27,36.06 36.87,33.32 39.43,33.12 40.3,32.36 v40.35,25.78 | v40.32,23.21 41.87,23.24 61.2,23.21 62.65,21.76 64.94,21.76 71.08,15.49 v74.38,15.49 | 87.47,17.65 v87.47,17.77 IC1.1
  Bottom 0.254: v24.04,50.69 23.99,50.72 v23.96,36.19 | v40.35,25.78 v40.32,23.21 | v74.38,15.49 85.69,15.49 87.47,17.14 v87.47,17.77
RS485_TX  (via drill 0.33)
  Top 0.254: U$6.47 arc90 39.84,60.88 39.84,59.96 40.48,59.61 v47.71,59.61 | v50.76,59.58 51.78,60.32 52.54,62.1 54.45,64.26 v57.7,64.28 | v57.7,74.7 v81.09,74.65 | v85.31,23.62 85.31,22.47 IC1.4
  Bottom 0.254: v47.71,59.61 v50.76,59.58 | v57.7,64.28 v57.7,74.7 | v81.09,74.65 81.17,35.12 85.41,35.05 85.31,29.71 v85.31,23.62
RS485A
  Top 0.254: J1.2 81.75,14.85 81.75,20.19 IC1.6 R16.1
RS485B
  Top 0.254: J1.1 76.67,15.24 R16.2 78.45,19.04 IC1.7
SCK  (via drill 0.33)
  Top 0.254: U$6.35 49.24,60.85 49.24,58.16 48.73,57.53 v40.35,57.53 | v28.16,24.12 29.68,24.12 U$8.5 31.92,23.5 R5.2 | 44.92,20.7 44.54,21.08 v35.01,21.08 | 44.92,20.7 U$7.5 | 44.92,20.7 45.17,20.95 53.43,20.95 54.19,20.19 U$2.5
  Bottom 0.254: v40.35,57.53 39.41,57.04 38.59,56.23 38.59,54.43 38.32,54.15 37.81,53.97 28.92,53.97 27.27,53.21 27.27,40.76 28.92,39.11 28.92,37.46 27.77,36.32 27.7,35 25.67,32.76 25.67,29.1 27.7,28.9 27.77,24.51 v28.16,24.12 31.97,24.12 v35.01,21.08
SCL  (via drill 0.33)
  Top 0.254: U$6.28 52.72,55.88 v67.14,55.88 | v79.97,55.8 v72.35,55.75 | v80.48,26.16 80.48,24.38 JP20.4 JP14.4 JP16.4 JP15.4 63.08,25.09 63.36,33.12 64.5,33.68 67.37,34.34 R12.2
  Bottom 0.254: v67.14,55.88 67.78,55.75 v72.35,55.75 | v80.48,26.16 80.61,55.06 v79.97,55.8
SDA  (via drill 0.33)
  Top 0.254: U$6.29 52.69,56.64 v66.26,56.64 | v82.79,56.89 v72.86,56.89 | R11.2 78.83,35.3 v81.81,35.79 v81.55,34.32 | JP15.3 JP16.3 JP14.3 JP20.3 v81.5,26.92
  Bottom 0.254: v66.26,56.64 66.89,56.89 v72.86,56.89 | v82.79,56.89 82.77,49.78 82.79,43.18 82.77,42.23 82.77,41.42 81.85,40.51 81.85,36.24 v81.81,35.79 | v81.5,26.92 81.5,29.92 81.55,33.73 v81.55,34.32
SS  (via drill 0.33)
  Top 0.254: 48.48,60.85 U$6.36 48.46,58.66 48.22,58.29 v39.05,58.29 | v27.09,18.51 26.89,17.32 26.89,14.88 27.9,13.86 29.96,13.84 U$8.1 32.35,13.5 R7.2
  Bottom 0.254: v39.05,58.29 39.05,57.58 38.14,56.51 37.55,54.45 28.41,54.45 26.63,53.46 26.63,40.51 27.9,39.24 27.9,37.46 27.27,36.83 27.27,35.17 25.11,33.02 25.11,28.7 27.14,28.44 27.06,18.54 v27.09,18.51
SS1  (via drill 0.33)
  Top 0.203: v74.82,48.99 74.26,48.33 66.1,48.33 65.39,47.57 65.29,47.26 65.29,36.22 64.48,35.86 49.7,35.86 v48.09,36.22
  Top 0.254: U$6.37 47.68,61.81 48.35,62.48 49.75,62.48 53.76,66.31 59.14,66.36 v59.22,66.75 | v74.87,73.83 v59.25,73.83 | U$7.6 43.65,19.17 v43.02,19.81
  Bottom 0.203: v74.82,48.99 74.97,49.73 75.09,73.22 v74.87,73.83
  Bottom 0.254: v59.22,66.75 59.22,69.54 v59.25,73.83 | v43.02,19.81 43.02,22.35 43.14,22.47 48.09,22.47 v48.09,36.22
SS2  (via drill 0.33)
  Top 0.203: 69.3,41.65 69.3,36.14 66.51,36.14 66.31,34.9 62.8,33.52 | v82.16,54.86 v72.86,54.86
  Top 0.254: U$6.27 67.34,55.05 v67.4,54.99 | v82.08,41.85 71.13,41.83 70.9,42.11 69.89,42.08 69.69,41.78 69.3,41.65 | 62.8,33.52 62.45,32.3 62.45,26.23 61.63,25.47 v55.72,25.47 | U$2.6 v52.92,20.06
  Bottom 0.254: v67.4,54.99 72.73,54.99 v72.86,54.86 | v82.16,54.86 82.13,41.8 v82.08,41.85 | v55.72,25.47 55.72,22.86 v52.92,20.06
TCK  (via drill 0.33)
  Top 0.254: U$6.2 39.84,45.28 39.84,43.05 21.42,43.05 21.04,43.43 v20.05,43.45 | v20.05,54.3 16.09,54.3 14.95,53.84 SV22.1 | R23.2 19.52,38.35 v20.03,38.86
  Bottom 0.254: v20.05,54.3 v20.05,43.45 20.03,42.79 v20.03,38.86
TDI
  Top 0.254: SV22.9 15.23,40.81 18.25,40.81 18.61,42.57 40.6,42.54 40.59,43.29 U$6.3
TDO  (via drill 0.33)
  Top 0.254: U$6.4 41.36,45.31 41.36,42.03 19.32,41.93 v19.27,41.85 | v18.76,51.3 16.47,51.3 16.22,51.18 15.08,50.03 SV22.3
  Bottom 0.254: v19.27,41.85 18.78,43 v18.76,51.3
TEMP_A  (via drill 0.33)
  Top 0.203: U$6.9 45.31,39.73 v45.28,39.75 | 72.73,36.19 v72.73,39.29 | R14.1 73.37,12.09 v73.37,12.19
  Top 0.254: v73.7,36.11 72.73,36.19 | v73.37,12.19 73.37,10.5 R13.1 73.08,10.28 C37.2
  Bottom 0.203: 67.81,39.49 45.99,39.47 45.71,39.75 v45.28,39.75 | v72.73,39.29 68.87,39.29 68.54,39.47
  Bottom 0.254: v73.7,36.11 73.67,33.57 75.25,32.84 75.3,23.08 71.82,23.08 70.95,22.09 69.94,22.09 68.67,20.82 68.67,14.85 69.05,14.47 71.08,14.47 v73.37,12.19 | 68.54,39.47 67.81,39.49
TEMP_B  (via drill 0.33)
  Top 0.203: 46.1,40.85 U$6.10 | R20.2 64.35,12.09 v64.35,11.93 | v73.88,39.21 74.61,39.19 74.82,39.19 78.85,39.21 79.16,39.7 79.16,41.09 v78.98,41.19 | v79.36,70.4 79.36,70.76 79.11,71.01 76.53,71.01 R9.1
  Top 0.254: v46.19,40.69 46.1,40.85 | v73.88,39.21 73.88,39.24 73.85,37.33 v73.34,36.93 | v64.35,11.93 63.63,11.93 R15.1 61.58,11.26 C39.2
  Bottom 0.203: v46.19,40.69 arc-39 47.21,40.71 arc60 48.02,40.58 69.53,40.74 70.02,40.25 70.09,40.2 71.54,40.2 71.79,39.95 72.12,39.92 73.27,39.92 73.47,39.59 v73.88,39.21 | v78.98,41.19 78.98,41.98 79.46,42.46 79.46,45.89 79.21,46.15 79.21,70.25 v79.36,70.4
  Bottom 0.254: v73.34,36.93 72.68,36.01 71.49,33.62 71.49,32.53 71.46,23.49 69.69,22.58 67.65,20.7 67.65,14.85 67.02,14.22 66.64,14.22 v64.35,11.93
TEMP_PLATFORM  (via drill 0.33)
  Top 0.203: 46.89,41.84 U$6.11 | R22.2 64.24,18.9 64.07,18.13 61.02,18.13 60.01,17.72 58.85,17.72 R21.1 58.79,19.97 C38.2
  Top 0.254: v46.95,41.78 46.89,41.84 | v66.64,41.88 66.66,37.13 v67.02,36.75 | v65.37,20.29 64.24,20.29 R22.2
  Bottom 0.203: v46.95,41.78 56.98,41.78 57.62,41.75 58.43,41.78 65.88,41.78 66.13,41.88 v66.64,41.88
  Bottom 0.254: v67.02,36.75 67.45,33.98 67.65,32.71 67.65,21.46 v65.37,20.29
TMS
  Top 0.254: SV22.5 13.55,47.49 13.55,41.4 14.82,40.13 19.01,40.13 19.65,40.76 20.43,41.37 42.13,41.4 42.16,42.83 U$6.5
USART2-RXD
  Top 0.254: U$6.62 37.15,48.76 29.81,48.76 29.68,48.64 28.28,48.13 21.98,48.13 21.98,55.11 12.15,55.11 8.47,53.46 5.04,51.05 4.18,48.15 3.62,47.32 JP5.4
USART2-TXD
  Top 0.254: U$6.61 37.15,49.53 29.17,49.53 27.9,48.76 22.49,48.76 22.49,56 11.65,56 7.58,53.72 4.53,52.19 JP5.5
VREF3.0V  (via drill 0.33)
  Top 0.254: U$6.18 53.72,47.96 v54.24,47.95 | v56.17,46.1 57.24,44.79 U1.4 57.75,44.16 57.75,43.05 57.37,42.67 56.86,42.67 56.24,43.29 C36.2
  Bottom 0.254: v56.17,46.1 v54.24,47.95
XDIR  (via drill 0.33)
  Top 0.203: v77.15,46.05 70.17,46.07 68.67,46.02 v68.69,40.08 | v44.31,40.48 43.78,40.94
  Top 0.254: U$6.7 43.78,45.28 43.78,40.94 | SV2.4 82.26,80.26 82.13,80 82.13,73.91 v77.05,73.91
  Bottom 0.203: v77.15,46.05 v77.05,73.91 | v44.31,40.48 45.45,40.48 46.19,39.87 v68.69,40.08
XIN0
  Top 0.406: U$6.39 46.06,60.84 46.06,66.29 46.13,66.29 Q1.3 C2.2
XMAX  (via drill 0.33)
  Top 0.254: U$6.58 36.56,51.89 36.23,51.89 35.4,51.1 26,51.1 25.41,51.53 23.36,51.53 v23.33,51.56 | X-MAX.4 43.09,34.03 37.12,34.03 35.52,38.35 v23.33,38.35
  Bottom 0.254: v23.33,38.35 v23.33,51.56
XMIN  (via drill 0.33)
  Top 0.254: U$6.57 37.15,52.7 36.23,52.68 35.14,51.56 26.48,51.58 v24.85,52.37 | v34.94,33.22 X-MIN.4 | v24.85,37.59 v34,37.54
  Bottom 0.254: v34,37.54 v34.94,33.22 | v24.85,37.59 v24.85,52.37
XOUT0
  Top 0.406: U$6.40 45.31,64.37 44.54,65.15 44.08,65.15 Q1.1 41.37,65.27 C1.2
XSTEP  (via drill 0.33)
  Top 0.203: v78.02,47.9 66.64,47.9 65.93,47.19 65.93,35.48 42.76,35.45
  Top 0.254: U$6.6 43.02,45.26 v42.76,40.64 | SV2.3 83.4,73.15 v77.94,73.15 | 42.76,35.45 v41.36,39.37
  Bottom 0.203: v78.02,47.9 v77.94,73.15
  Bottom 0.254: v41.36,39.37 v42.76,40.64
XYZENB  (via drill 0.33)
  Top 0.203: v78.73,45.33 70.42,45.33 v69.46,45.31
  Top 0.254: 50.76,45.26 U$6.16 50.88,45.42 51.09,45.41 v53.76,45.21
  Bottom 0.203: v78.73,45.33 78.58,75.69 | v53.76,45.21 65.7,45.23 65.93,45.87 68.87,45.87 v69.46,45.31
  Bottom 0.254: SV2.5 85.99,77.44 77.25,77.44 | SV3.5 69.58,77.44 77.25,77.44 | 78.58,75.69 77.25,77.44
YDIR  (via drill 0.33)
  Top 0.254: U$6.25 52.69,53.46 v61.05,53.46 | SV3.4 65.75,80.26 59.91,80.26 v59.91,75.94
  Bottom 0.254: v59.91,75.94 59.91,64.89 62.83,61.97 62.83,55.11 v61.05,53.46
YMAX  (via drill 0.33)
  Top 0.203: Y-MAX.4 56.48,34.9 38.04,34.92
  Top 0.254: U$6.55 37.12,54.3 36.01,54.25 36.01,53.23 34.89,51.99 28.64,51.99 28.59,53.84 v23.33,53.84 | 38.04,34.92 36.41,39.62 21.48,39.62 v20.84,39.42
  Bottom 0.254: v20.84,39.42 20.61,41.32 20.89,43.12 20.89,44.22 20.61,44.6 20.59,52.68 v23.33,53.84
YMIN  (via drill 0.33)
  Top 0.203: Y-MIN.4 51.02,34.49 45.94,34.49
  Top 0.254: U$6.54 37.1,55.11 v35.78,55.09 | 45.94,34.49 37.61,34.51 35.9,39.11 v22.7,38.98 | v24.22,55.11 32.42,55.14 33.39,55.14 v33.59,55.16
  Bottom 0.254: v22.7,38.98 22.34,39.77 22.31,52.45 24.22,53.34 v24.22,55.11 | v33.59,55.16 v35.78,55.09
YSTEP  (via drill 0.33)
  Top 0.254: U$6.24 52.69,52.7 v65.27,52.7 | v72,57.76 v80.35,57.78 | v80.25,75.69 80,75.81 67.02,75.81 SV3.3
  Bottom 0.254: v65.27,52.7 65.29,57.76 v72,57.76 | v80.35,57.78 v80.25,75.69
ZDIR  (via drill 0.33)
  Top 0.254: U$6.31 52.72,58.16 v55.46,58.16 | SV4.4 51.14,81.53 52.29,80.39 54.45,80.39 v54.7,80.13
  Bottom 0.254: v54.7,80.13 54.7,70.1 56.22,68.57 56.22,66.67 55.72,66.16 55.33,65.91 53.68,64.26 53.66,59.56 v55.46,58.16
ZENB  (via drill 0.33)
  Top 0.203: v73.6,47.24 66.74,47.21 v66.66,45.16 | 50,45.23 v50.05,43.79
  Top 0.254: U$6.15 50,45.23 | v61.18,70.73 v53.18,70.73
  Bottom 0.203: v73.6,47.24 73.67,47.26 73.75,70.23 | v50.05,43.79 50.84,44.57 50.94,44.62 53.96,44.6 54.62,44.78 66.31,44.75 v66.66,45.16
  Bottom 0.254: SV4.5 53.18,78.99 v53.18,70.73 | v61.18,70.73 62.19,73.02 72.99,73.02 72.99,70.99 73.75,70.23
ZMAX
  Top 0.254: U$6.46 arc90 40.6,60.85 40.6,62.5 38.44,62.5 38.44,69.84 Z-MAX.4
ZMIN
  Top 0.254: U$6.45 arc-90 41.36,60.85 41.36,62.58 41.34,62.94 41.03,63.14 38.93,63.14 38.93,71.52 38.19,72.05 36.82,72.03 23.58,72.03 23.58,68.17 20.28,68.17 20.28,69.97 Z-MIN.4
ZSTEP  (via drill 0.33)
  Top 0.254: U$6.30 52.69,57.4 53.94,57.4 54.06,57.53 v61.05,57.53 | SV4.3 50.51,77.72 52.03,76.19 58,76.19 v58.48,75.48
  Bottom 0.254: v58.48,75.48 58.48,64.94 61.3,62.23 61.3,57.78 v61.05,57.53

### Text on the board
tPlace: B AXIS | A AXIS | Z AXIS | Y AXIS | X AXIS | ATUC3B0256 on board!! | USB | BLK | ESTOP | ZMIN | ZAMX | Motherboard | RepRap32 | GRN | JTAG | Pin1 | RESET | PWM | AVR32 Powered | 1/31/2011 | I2C | C3 | Generation 1.0 | WALI Technologies LLC | +5V | GND | SDA | SCL | XMIN | XMAX | YMIN | YMAX | GPLV3 | T1- | T1+ | TEMPB | TEMPA | T2- | T2+ | RS485 | Extruder | License: GPLV3 | RepRap32 bit | Dsn By: David Anderson